# EAGLE schematic emote-mfrc522 (EAGLE 8.3.2)
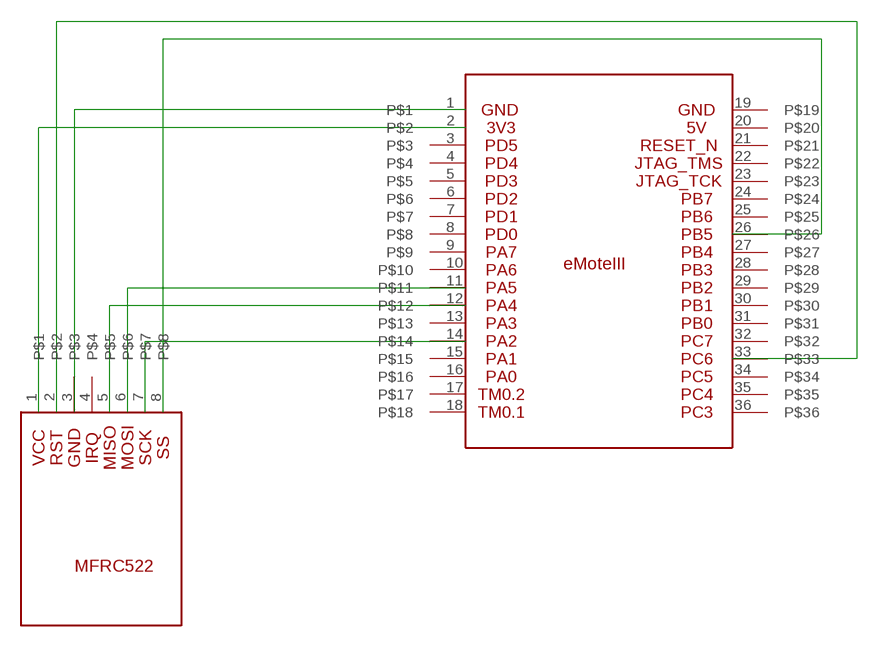
[diagram p0: schematic, sheet 1]

## Parts
U$1  EMOTE3  [2X18]
U$2  MFC522  [70543-08]

## Nets
N$1: U$1.2 U$2.1
N$2: U$1.1 U$2.3
N$3: U$1.33 U$2.2
N$4: U$1.12 U$2.5
N$5: U$1.11 U$2.6
N$6: U$1.14 U$2.7
N$7: U$1.26 U$2.8
Unconnected: U$1.3 U$1.4 U$1.5 U$1.6 U$1.7 U$1.8 U$1.9 U$1.10 U$1.13 U$1.15 U$1.16 U$1.17 U$1.18 U$1.19 U$1.20 U$1.21 U$1.22 U$1.23 U$1.24 U$1.25 U$1.27 U$1.28 U$1.29 U$1.30 U$1.31 U$1.32 U$1.34 U$1.35 U$1.36 U$2.4

## Library data of the parts
U$1 = emote3:EMOTE3
U$2 = mfrc522:MFC522